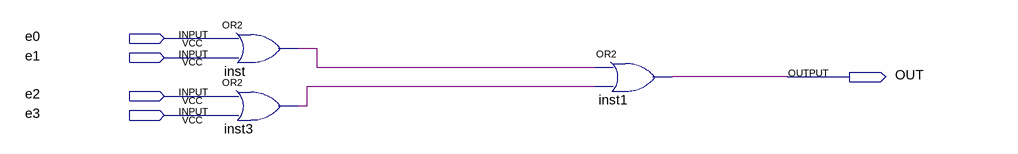
[diagram p0: schematic sheet]
// Quartus schematic zero1.bdf as structural Verilog: 3 symbols, 5 pins
module zero1 (
  input  e0,
  input  e1,
  input  e2,
  input  e3,
  output OUT
);

  wire inst3_out, inst_out;

  or inst (inst_out, e0, e1);
  or inst3 (inst3_out, e2, e3);
  or inst1 (OUT, inst_out, inst3_out);
endmodule
